# Altium project pca10095.PrjPCB (part 1 of 5)
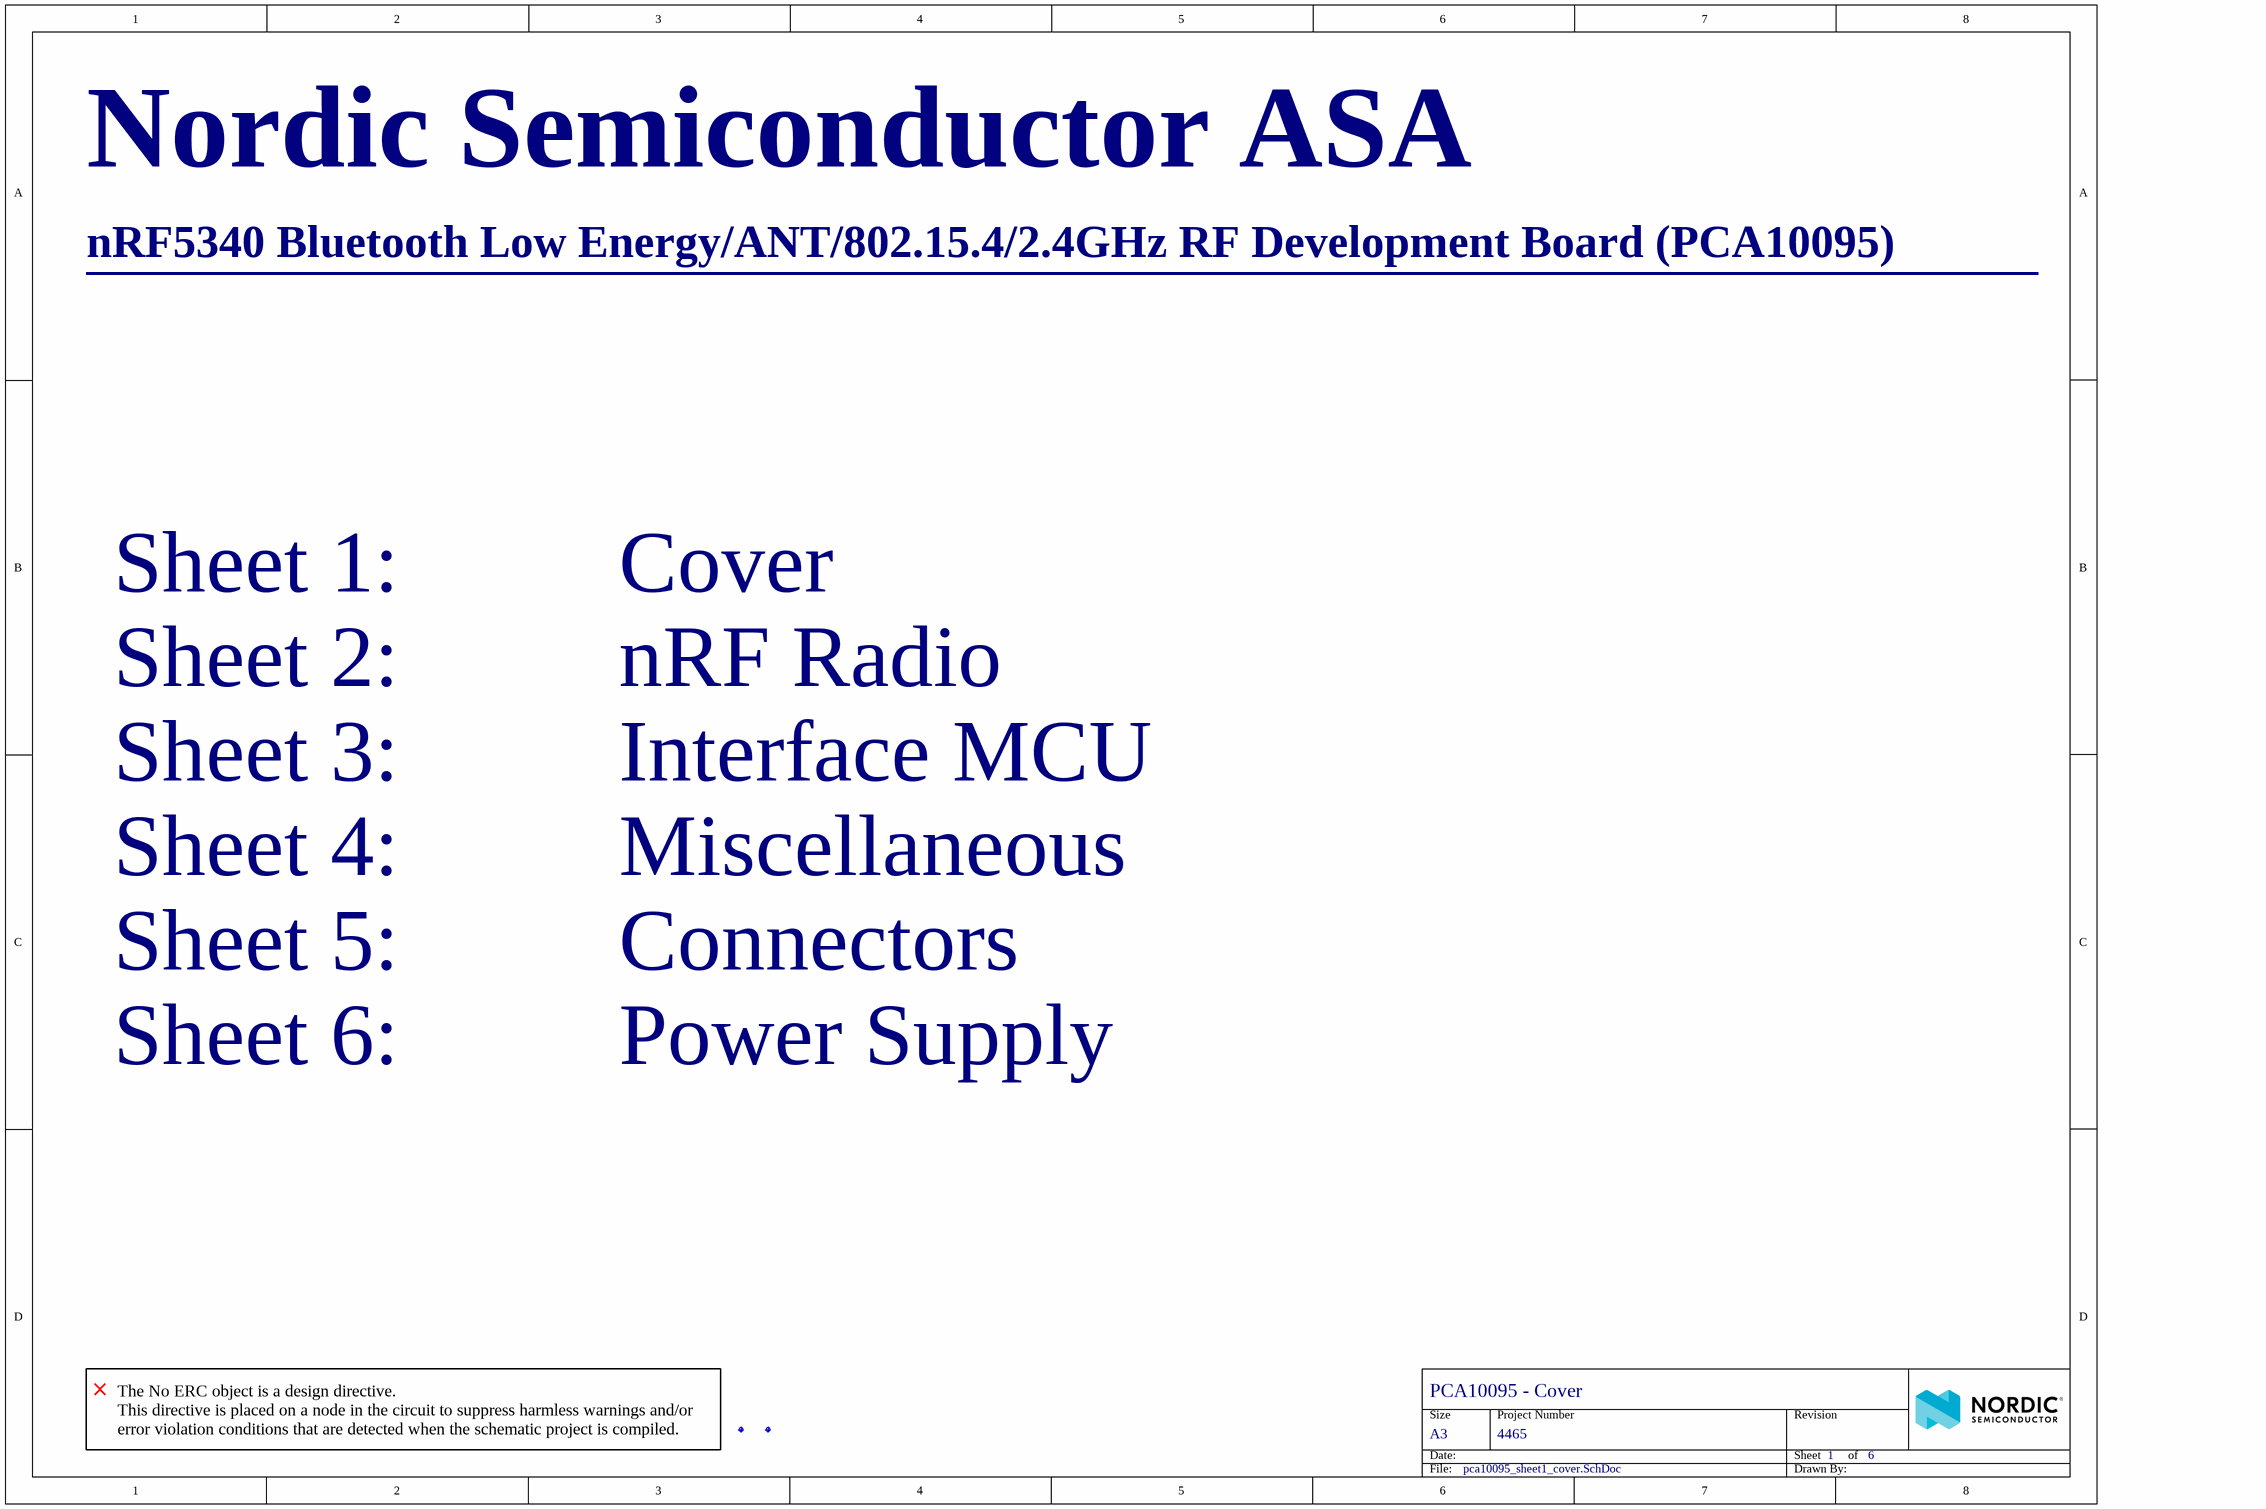
[diagram p0: pca10095_sheet1_cover.SchDoc]
Auth: GETR; BoardThickness: 1.6mm; BoardTitle: nRF5340 Bluetooth Smart/ANT/802.15.4/2.4GHz RF Development Board; NrOfLayers: 4; Organization: Nordic Semiconductor; PCAName: PCA10095; PCBNumber: 400432; PCBRevision: 0149GETR; PCBStackup: 4001; ProjectName: nRF53 Development Kit; ProjectNumber: 4465; Rev: 2.0.0; SilkscreenColor: White; SoldermaskColor: Blue; SurfaceFinish: ENIG Gold
6 sheets, 354 parts. Net scope: flat (ports and power ports of the same name join across sheets).
Board file: 400432.PcbDoc
Sheets:
  pca10095_sheet1_cover.SchDoc
  pca10095_sheet2_nrf5340_mcu.SchDoc
  pca10095_sheet3_interface_mcu.SchDoc
  pca10095_sheet4_misc.SchDoc
  pca10095_sheet5_connectors.SchDoc
  pca10095_sheet6_power_supply.SchDoc

## Sheet pca10095_sheet1_cover.SchDoc: PCA10095 - Cover
size A3; Organization: Nordic Semiconductor; DocumentNumber: 1; Revision: 2.0.0; SheetNumber: 1; SheetTotal: 6; Author: GETR; CompanyName: Nordic Semiconductor; ProjectName: nRF53 Development Kit

### Parts
Fid1  Fiducial mark  [Fiducial]  (value not drawn)
Fid2  Fiducial mark  [Fiducial]  (value not drawn)

### Notes on the sheet
- Nordic Semiconductor ASA
- nRF5340 Bluetooth Low Energy/ANT/802.15.4/2.4GHz RF Development Board (PCA10095)
- ________________________________________________________________
- Sheet 1:          Cover
- Sheet 2:          nRF Radio
- Sheet 3:          Interface MCU
- Sheet 4:          Miscellaneous
- Sheet 5:          Connectors
- Sheet 6:          Power Supply
- (near Fid1) The No ERC object is a design directive.
  This directive is placed on a node in the circuit to suppress harmless warnings and/or error violation conditions that are detected when the schematic project is compiled.
- Size
- Date:
- A3
- Project Number
- Sheet         of
- Revision
- File:
- Drawn By:

### Library data of the parts
Fid1 Fid2 = Fid-Mark: Artikkelnr Noca: N.A.; Part Number: Fid-Mark; Manufacturer: *; Manufacturer Part Number: *; LatestRevisionDate: 2009-12-12; Pin Count: 1; Publisher: Nordic Semiconductor; Published: 2009-12-12; Value: *; Note: *; Footprint Doc: Fiducial; Part number IPS: N.A.; ComponentLink1URL: *; ComponentLink1Description: Datasheet; ComponentLink2URL: *; ComponentLink2Description: Supplier link; HelpURL: *; Supplier 1: *; Supplier Part Number 1: *; Supplier 2: *; Supplier Part Number 2: *

## Sheet pca10095_sheet2_nrf5340_mcu.SchDoc: PCA10095 - nRF5340 MCU
size A3; Organization: Nordic Semiconductor; DocumentNumber: 2; Revision: 2.0.0; SheetNumber: 2; SheetTotal: 6; Author: GETR; CompanyName: Nordic Semiconductor; ProjectName: nRF53 Development Kit
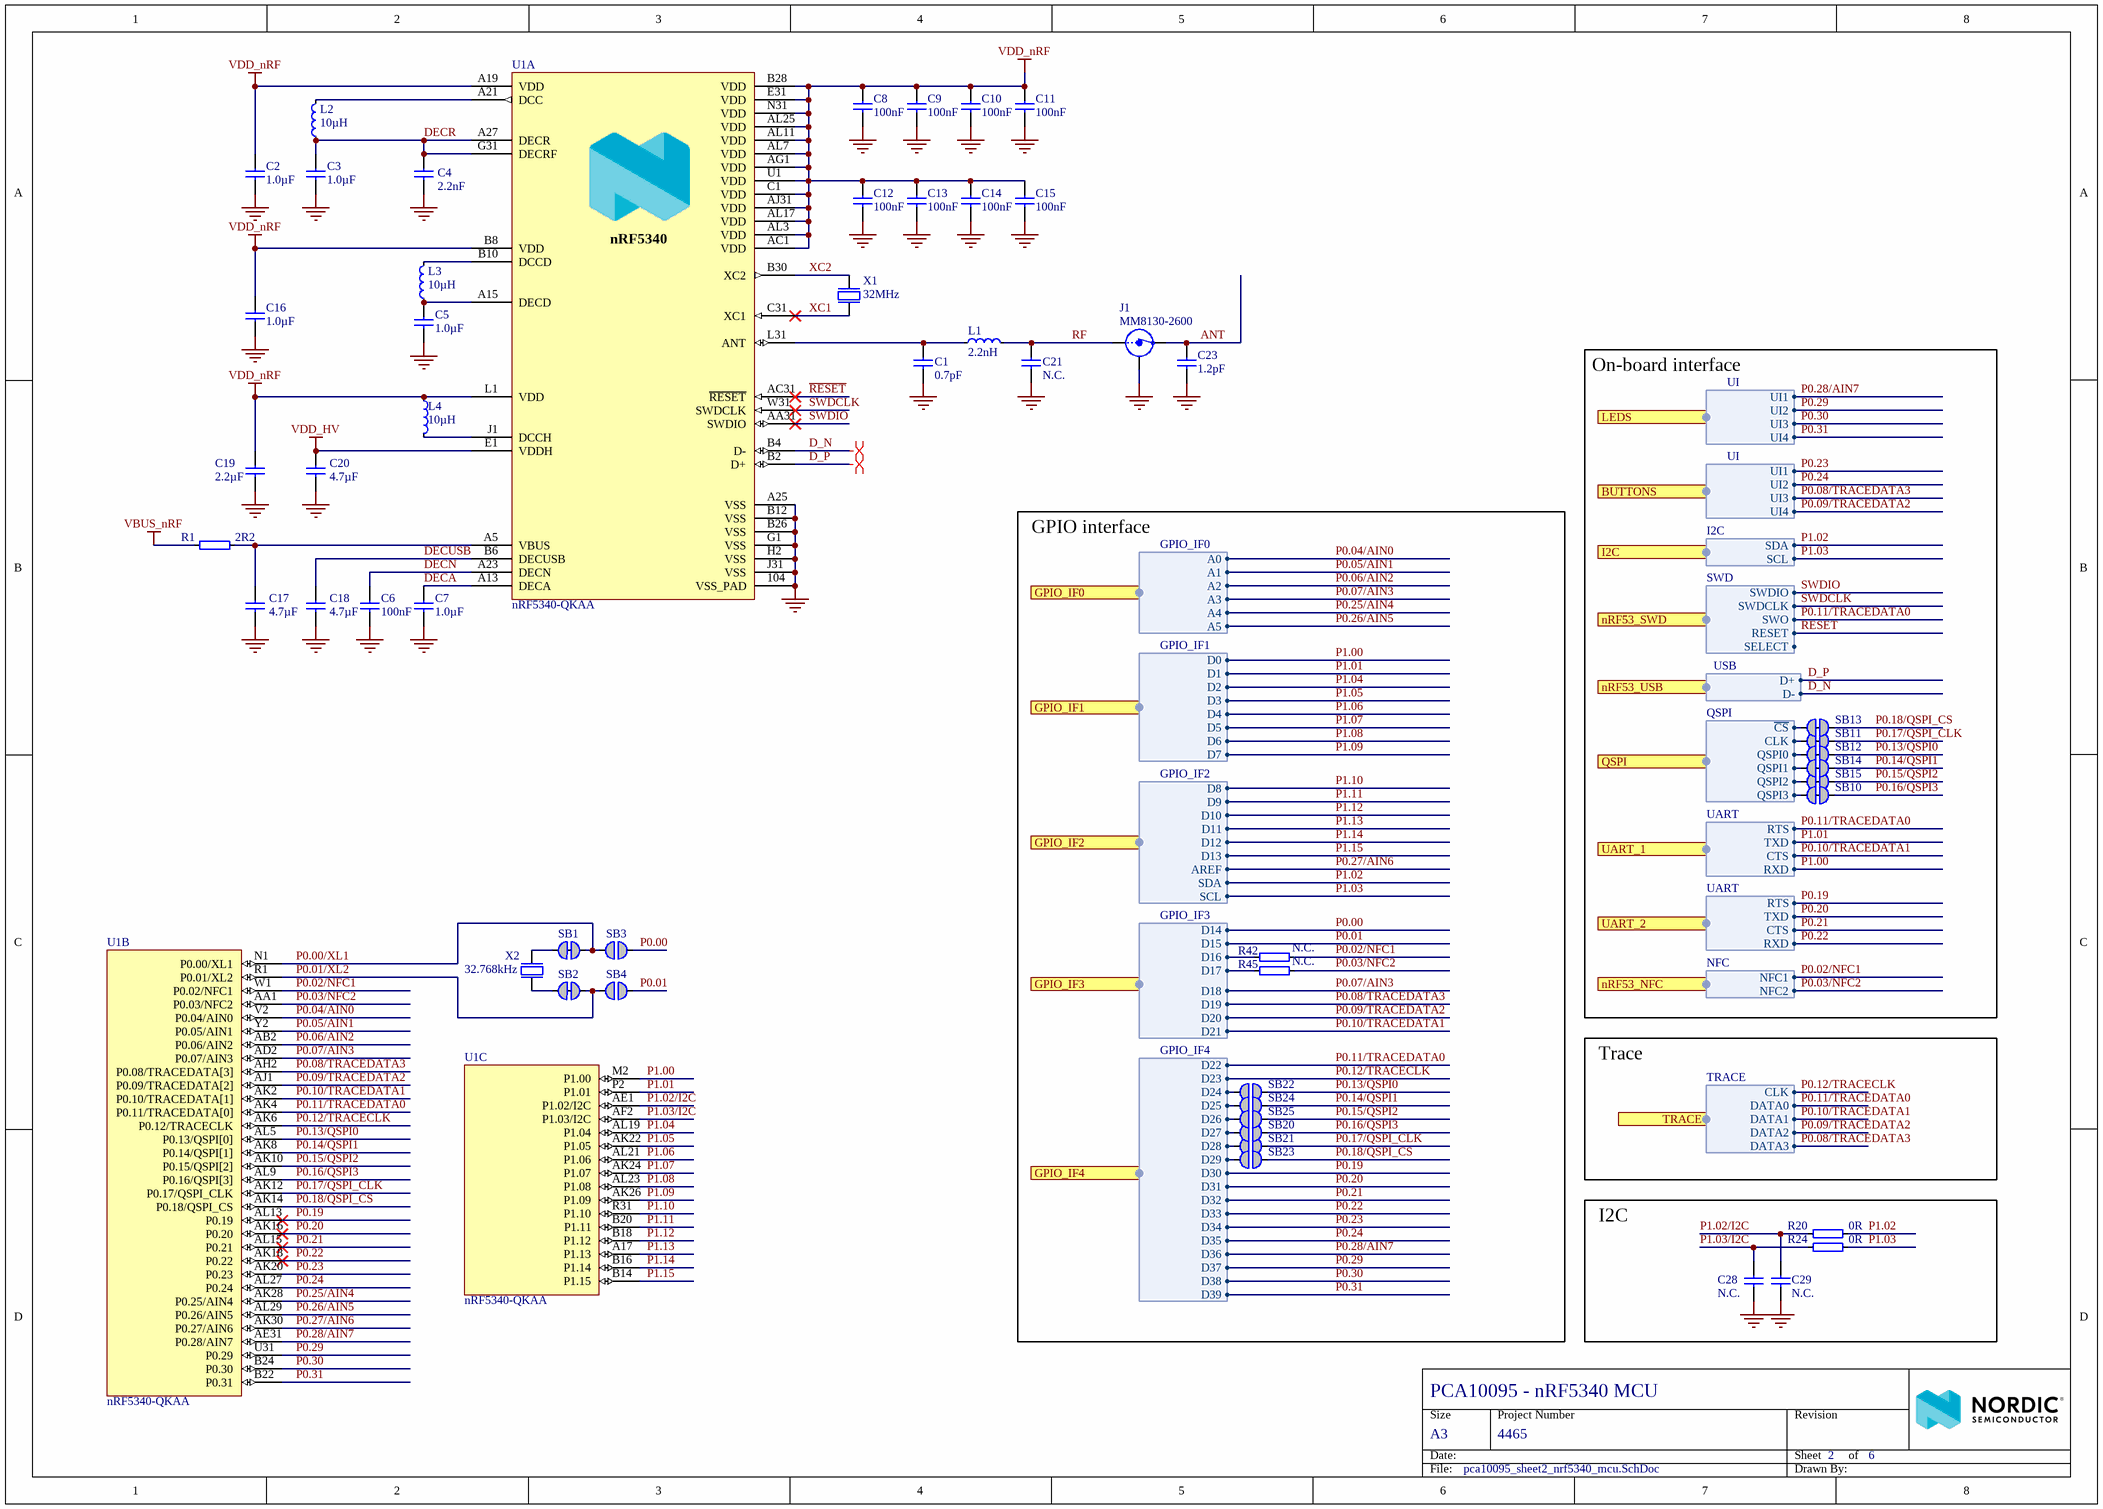
[diagram p1: pca10095_sheet2_nrf5340_mcu.SchDoc]

### Parts
C1  0.7pF  [CAPC0603X03L_C]
C2  1.0µF  [CAPC1005X04L]
C3  1.0µF  [CAPC1005X04L]
C4  2.2nF  [CAPC0603X03L_C]
C5  1.0µF  [CAPC1005X04L]
C6  100nF  [CAPC0603X03L_C]
C7  1.0µF  [CAPC1005X04L]
C8  100nF  [CAPC0603X03L_C]
C9  100nF  [CAPC0603X03L_C]
C10  100nF  [CAPC0603X03L_C]
C11  100nF  [CAPC0603X03L_C]
C12  100nF  [CAPC0603X03L_C]
C13  100nF  [CAPC0603X03L_C]
C14  100nF  [CAPC0603X03L_C]
C15  100nF  [CAPC0603X03L_C]
C16  1.0µF  [CAPC1005X04L]
C17  4.7µF  [CAPC1608X06L]
C18  4.7µF  [CAPC1608X06L]
C19  2.2µF  [CAPC1608X06L]
C20  4.7µF  [CAPC1608X06L]
C21  N.C.  [CAPC0603X03L_C_NC]
C23  1.2pF  [CAPC1005X04L]
C28  N.C.  [CAPC0603X03L_C_NC]
C29  N.C.  [CAPC0603X03L_C_NC]
J1  MM8130-2600  [COAXIAL-SWF]
L1  2.2nH  [INDC0603X03L_C]
L2  10µH  [INDC1608X06L]
L3  10µH  [INDC1608X06L]
L4  10µH  [INDC1608X06L]
R1  2R2  [RESC0603X03L_C]
R20  0R  [RESC0603X03L_C]
R24  0R  [RESC0603X03L_C]
R42  N.C.  [RESC0603X03L_C_NC]
R45  N.C.  [RESC0603X03L_C_NC]
SB1  Solderbridge  [Solderbridge_Shorted]  (value not drawn)  (net tie, no BOM)
SB2  Solderbridge  [Solderbridge_Shorted]  (value not drawn)  (net tie, no BOM)
SB3  Solderbridge  [Solderbridge]  (value not drawn)  (no BOM)
SB4  Solderbridge  [Solderbridge]  (value not drawn)  (no BOM)
SB10  Solderbridge  [Solderbridge_Shorted]  (value not drawn)  (net tie, no BOM)
SB11  Solderbridge  [Solderbridge_Shorted]  (value not drawn)  (net tie, no BOM)
SB12  Solderbridge  [Solderbridge_Shorted]  (value not drawn)  (net tie, no BOM)
SB13  Solderbridge  [Solderbridge_Shorted]  (value not drawn)  (net tie, no BOM)
SB14  Solderbridge  [Solderbridge_Shorted]  (value not drawn)  (net tie, no BOM)
SB15  Solderbridge  [Solderbridge_Shorted]  (value not drawn)  (net tie, no BOM)
SB20  Solderbridge  [Solderbridge]  (value not drawn)  (no BOM)
SB21  Solderbridge  [Solderbridge]  (value not drawn)  (no BOM)
SB22  Solderbridge  [Solderbridge]  (value not drawn)  (no BOM)
SB23  Solderbridge  [Solderbridge]  (value not drawn)  (no BOM)
SB24  Solderbridge  [Solderbridge]  (value not drawn)  (no BOM)
SB25  Solderbridge  [Solderbridge]  (value not drawn)  (no BOM)
U1  nRF5340-QKAA  [AQFN40P700X700X85_HS-99N]  (parts A,B,C of 3)
X1  32MHz  [BT-XTAL_2016]
X2  32.768kHz  [XTAL_2012]

### Blocks framed on the sheet
On-board interface: SB10-SB15
GPIO interface: R42 R45 SB20-SB25
I2C: C28 C29 R20 R24

### Ports
BUTTONS (harness UI), GPIO_IF0 (harness GPIO_IF0), GPIO_IF1 (harness GPIO_IF1), GPIO_IF2 (harness GPIO_IF2), GPIO_IF3 (harness GPIO_IF3), GPIO_IF4 (harness GPIO_IF4), I2C (harness I2C), LEDS (harness UI), nRF53_NFC (harness NFC), nRF53_SWD (harness SWD), nRF53_USB (harness USB), QSPI (harness QSPI), TRACE (harness TRACE), UART_1 (harness UART), UART_2 (harness UART)

### Harnesses
QSPI: ~{CS}, QSPI0, CLK, QSPI1, QSPI2, QSPI3
SWD: SWDIO, SWDCLK, SWO, RESET, SELECT
UI: UI4, UI3, UI2, UI1
USB: D+, D-
TRACE: CLK, DATA0, DATA1, DATA3, DATA2
NFC: NFC2, NFC1
UART: RTS, CTS, RXD, TXD
GPIO_IF1: D0, D1, D2, D3, D4, D5, D6, D7
GPIO_IF2: D8, D9, D10, D11, D12, D13, AREF, SDA, SCL
GPIO_IF0: A0, A1, A2, A3, A4, A5
GPIO_IF3: D14, D15, D16, D17, D18, D19, D20, D21
I2C: SCL, SDA
GPIO_IF4: D22, D23, D24, D25, D26, D27, D28, D29, D30, D31, D32, D33, D34, D35, D36, D37, D38, D39

### Nets
GND: C1.1 C2.2 C3.1 C4.2 C5.1 C6.2 C7.1 C8.2 C9.2 C10.2 C11.2 C12.2 C13.2 C14.2 C15.2 C16.1 C17.2 C18.2 C19.2 C20.2 C21.1 C23.2 C28.1 C29.1 J1.2(Shield) U1.104(VSS_PAD) U1.A25(VSS) U1.B12(VSS) U1.B26(VSS) U1.G1(VSS) U1.H2(VSS) U1.J31(VSS) X1.2(GND) X1.4(GND)
VBUS_nRF: R1.1
VDD_HV: C20.1 U1.E1(VDDH)
VDD_nRF: C2.1 C8.1 C9.1 C10.1 C11.1 C12.1 C13.1 C14.1 C15.1 C16.2 C19.1 L4.1 U1.A19(VDD) U1.AC1(VDD) U1.AG1(VDD) U1.AJ31(VDD) U1.AL3(VDD) U1.AL7(VDD) U1.AL11(VDD) U1.AL17(VDD) U1.AL25(VDD) U1.B8(VDD) U1.B28(VDD) U1.C1(VDD) U1.E31(VDD) U1.L1(VDD) U1.N31(VDD) U1.U1(VDD)
ANT: C23.1 J1.3(OUT)
D_N: U1.B4(D-) ; port nRF53_USB.D-
D_P: U1.B2(D+) ; port nRF53_USB.D+
DECA: C7.2 U1.A13(DECA)
DECN: C6.1 U1.A23(DECN)
DECR: C3.2 C4.1 L2.1 U1.A27(DECR) U1.G31(DECRF)
DECUSB: C18.1 U1.B6(DECUSB)
MX25_~{CS}: SB13.2 ; port QSPI.~{CS}
MX25_SCLK: SB11.2 ; port QSPI.CLK
MX25_SIO0: SB12.2 ; port QSPI.QSPI0
MX25_SIO1: SB14.2 ; port QSPI.QSPI1
MX25_SIO2: SB15.2 ; port QSPI.QSPI2
MX25_SIO3: SB10.2 ; port QSPI.QSPI3
P0.00: SB3.2 ; port GPIO_IF3.D14
P0.00/XL1: SB1.2 SB3.1 U1.N1(P0.00/XL1)
P0.01: SB4.2 ; port GPIO_IF3.D15
P0.01/XL2: SB2.2 SB4.1 U1.R1(P0.01/XL2)
P0.02/NFC1: R42.2 U1.W1(P0.02/NFC1) ; port nRF53_NFC.NFC1
P0.03/NFC2: R45.2 U1.AA1(P0.03/NFC2) ; port nRF53_NFC.NFC2
P0.04/AIN0: U1.V2(P0.04/AIN0) ; port GPIO_IF0.A0
P0.05/AIN1: U1.Y2(P0.05/AIN1) ; port GPIO_IF0.A1
P0.06/AIN2: U1.AB2(P0.06/AIN2) ; port GPIO_IF0.A2
P0.07/AIN3: U1.AD2(P0.07/AIN3) ; port GPIO_IF0.A3, port GPIO_IF3.D18
P0.08/TRACEDATA3: U1.AH2(P0.08/TRACEDATA[3]) ; port BUTTONS.UI3, port TRACE.DATA3, port GPIO_IF3.D19
P0.09/TRACEDATA2: U1.AJ1(P0.09/TRACEDATA[2]) ; port BUTTONS.UI4, port TRACE.DATA2, port GPIO_IF3.D20
P0.10/TRACEDATA1: U1.AK2(P0.10/TRACEDATA[1]) ; port TRACE.DATA1, port GPIO_IF3.D21, port UART_1.CTS
P0.11/TRACEDATA0: U1.AK4(P0.11/TRACEDATA[0]) ; port nRF53_SWD.SWO, port TRACE.DATA0, port GPIO_IF4.D22, port UART_1.RTS
P0.12/TRACECLK: U1.AK6(P0.12/TRACECLK) ; port TRACE.CLK, port GPIO_IF4.D23
P0.13/QSPI0: SB12.1 SB22.1 U1.AL5(P0.13/QSPI[0])
P0.14/QSPI1: SB14.1 SB24.1 U1.AK8(P0.14/QSPI[1])
P0.15/QSPI2: SB15.1 SB25.1 U1.AK10(P0.15/QSPI[2])
P0.16/QSPI3: SB10.1 SB20.1 U1.AL9(P0.16/QSPI[3])
P0.17/QSPI_CLK: SB11.1 SB21.1 U1.AK12(P0.17/QSPI_CLK)
P0.18/QSPI_CS: SB13.1 SB23.1 U1.AK14(P0.18/QSPI_CS)
P0.19: U1.AL13(P0.19) ; port UART_2.RTS, port GPIO_IF4.D30
P0.20: U1.AK16(P0.20) ; port UART_2.TXD, port GPIO_IF4.D31
P0.21: U1.AL15(P0.21) ; port UART_2.CTS, port GPIO_IF4.D32
P0.22: U1.AK18(P0.22) ; port UART_2.RXD, port GPIO_IF4.D33
P0.23: U1.AK20(P0.23) ; port BUTTONS.UI1, port GPIO_IF4.D34
P0.24: U1.AL27(P0.24) ; port BUTTONS.UI2, port GPIO_IF4.D35
P0.25/AIN4: U1.AK28(P0.25/AIN4) ; port GPIO_IF0.A4
P0.26/AIN5: U1.AL29(P0.26/AIN5) ; port GPIO_IF0.A5
P0.27/AIN6: U1.AK30(P0.27/AIN6) ; port GPIO_IF2.AREF
P0.28/AIN7: U1.AE31(P0.28/AIN7) ; port LEDS.UI1, port GPIO_IF4.D36
P0.29: U1.U31(P0.29) ; port LEDS.UI2, port GPIO_IF4.D37
P0.30: U1.B24(P0.30) ; port LEDS.UI3, port GPIO_IF4.D38
P0.31: U1.B22(P0.31) ; port LEDS.UI4, port GPIO_IF4.D39
P1.00: U1.M2(P1.00) ; port GPIO_IF1.D0, port UART_1.RXD
P1.01: U1.P2(P1.01) ; port GPIO_IF1.D1, port UART_1.TXD
P1.02: R20.1 ; port GPIO_IF2.SDA, port I2C.SDA
P1.02/I2C: C29.2 R20.2 U1.AE1(P1.02/I2C)
P1.03: R24.1 ; port GPIO_IF2.SCL, port I2C.SCL
P1.03/I2C: C28.2 R24.2 U1.AF2(P1.03/I2C)
P1.04: U1.AL19(P1.04) ; port GPIO_IF1.D2
P1.05: U1.AK22(P1.05) ; port GPIO_IF1.D3
P1.06: U1.AL21(P1.06) ; port GPIO_IF1.D4
P1.07: U1.AK24(P1.07) ; port GPIO_IF1.D5
P1.08: U1.AL23(P1.08) ; port GPIO_IF1.D6
P1.09: U1.AK26(P1.09) ; port GPIO_IF1.D7
P1.10: U1.R31(P1.10) ; port GPIO_IF2.D8
P1.11: U1.B20(P1.11) ; port GPIO_IF2.D9
P1.12: U1.B18(P1.12) ; port GPIO_IF2.D10
P1.13: U1.A17(P1.13) ; port GPIO_IF2.D11
P1.14: U1.B16(P1.14) ; port GPIO_IF2.D12
P1.15: U1.B14(P1.15) ; port GPIO_IF2.D13
~{RESET}: U1.AC31(~{RESET}) ; port nRF53_SWD.RESET
RF: C21.2 J1.1(IN) L1.2
SWDCLK: U1.W31(SWDCLK) ; port nRF53_SWD.SWDCLK
SWDIO: U1.AA31(SWDIO) ; port nRF53_SWD.SWDIO
XC1: U1.C31(XC1) X1.1(inp)
XC2: U1.B30(XC2) X1.3(out)
NetC1_2: C1.2 L1.1 U1.L31(ANT)
NetC5_2: C5.2 L3.1 U1.A15(DECD)
NetC17_1: C17.1 R1.2 U1.A5(VBUS)
NetL2_2: L2.2 U1.A21(DCC)
NetL3_2: L3.2 U1.B10(DCCD)
NetL4_2: L4.2 U1.J1(DCCH)
NetP6_3: R42.1 ; port GPIO_IF3.D16
NetP6_4: R45.1 ; port GPIO_IF3.D17
NetP24_3: SB22.2 ; port GPIO_IF4.D24
NetP24_4: SB24.2 ; port GPIO_IF4.D25
NetP24_5: SB25.2 ; port GPIO_IF4.D26
NetP24_6: SB20.2 ; port GPIO_IF4.D27
NetP24_7: SB21.2 ; port GPIO_IF4.D28
NetP24_8: SB23.2 ; port GPIO_IF4.D29
NetSB1_1: SB1.1 X2.1(inp)
NetSB2_1: SB2.1 X2.2(out)

Not connected (* = marked no-connect by the designer): U1 AG31(N.C.) D2(N.C.) F2(N.C.) T2(N.C.)

### Layout directives
differential pair: D_N, D_P

### Notes on the sheet
- Trace
- Size
- Date:
- A3
- Project Number
- Sheet         of
- Revision
- File:
- Drawn By:
- (in symbol nRF5340-QKAAD0, part A) nRF5340

### Library data of the parts
C1 = C0201-0.7p-HQ-Murata: Ceramic Capacitor C0G, NP0 0201, ±0.1pF 25V; Manufacturer: Murata; Manufacturer Part Number: GJM0335C1ER70BB01D; Artikkelnr Noca: N.A.; Pad Count: 2; Part Number: C0201-0.7p-HQ-Murata; LatestRevisionDate: 2020-10-13; Pin Count: 2; Publisher: Nordic Semiconductor; Published: 2020-03-05; Value: 0.7pF; Note: 25V; Footprint Doc: 0201; ComponentLink1URL: https://search.murata.co.jp/Ceramy/image/img/A01X/G101/ENG/GJM0335C1ER70BB01-01.pdf; ComponentLink1Description: Datasheet; ComponentLink2URL: https://www.murata.com/en-eu/products/productdetail?partno=GJM0335C1ER70BB01%23; ComponentLink2Description: Supplier link; HelpURL: https://www.digikey.no/product-detail/en/murata-electronics/GJM0335C1ER70BB01D/490-8076-1-ND/4380362; Supplier 1: Digi-Key; Supplier Part Number 1: 490-8076-1-ND; Supplier 2: N.A.; Supplier Part Number 2: N.A.; Part number IPS: N.A.; Component Class: Capacitors; PartId: 100200441
C2 C3 C5 C7 C16 = C0402-1µ0: Capacitor, X5R, ±5%, 6.3V; Manufacturer: N.A.; Part number IPS: 00000007786, 00000003457; Artikkelnr Noca: 20039235; Pad Count: 2; Part Number: C0402-1µ0; Manufacturer Part Number: N.A.; LatestRevisionDate: 2016-08-22; Pin Count: 2; Publisher: Nordic Semiconductor; Published: 2009-05-08; Value: 1.0µF; Note: 6.3V; Footprint Doc: 0402; ComponentLink1URL: N.A.; ComponentLink1Description: Datasheet; ComponentLink2URL: N.A.; ComponentLink2Description: Supplier link; HelpURL: N.A.; Supplier 1: Digi-Key; Supplier Part Number 1: 1276-1444-1-ND; Supplier 2: N.A.; Supplier Part Number 2: N.A.; Component Class: Capacitors; PartId: 100200190
C4 = C0201-2n2: Capacitor, X7R, ±10%, 10V; Manufacturer: N.A.; Part number IPS: 00000001778; Pad Count: 2; Part Number: C0201-2n2; LatestRevisionDate: 2014-11-13; Pin Count: 2; Published: 2014-11-13; Value: 2.2nF; Footprint Doc: 0201; Manufacturer Part Number: N.A.; ComponentLink1URL: N.A.; ComponentLink1Description: Datasheet; ComponentLink2URL: N.A.; ComponentLink2Description: Supplier link; HelpURL: N.A.; Publisher: Nordic Semiconductor; Note: 10V; Supplier 1: N.A.; Supplier Part Number 1: N.A.; Supplier 2: N.A.; Supplier Part Number 2: N.A.; Artikkelnr Noca: N.A.; Component Class: Capacitors; PartId: 100200060
C6 C8-C15 = C0201-100n: Capacitor, X5R, ±10%; Manufacturer: N.A.; Part number IPS: 00000001248, 00000002505; Note: 16V; Pad Count: 2; Part Number: C0201-100n; Manufacturer Part Number: N.A.; LatestRevisionDate: 2017-11-09; Pin Count: 2; Publisher: Nordic Semiconductor; Published: 2014-11-13; Value: 100nF; Artikkelnr Noca: N.A.; Footprint Doc: 0201; ComponentLink1URL: N.A.; ComponentLink1Description: Datasheet; ComponentLink2URL: N.A.; ComponentLink2Description: Supplier link; HelpURL: N.A.; Supplier 1: N.A.; Supplier Part Number 1: N.A.; Supplier 2: N.A.; Supplier Part Number 2: N.A.; Component Class: Capacitors; PartId: 100200078
C17 C18 C20 = C0603-4µ7-10V-X7S: Capacitor, X7S, ±10%, 10V; Manufacturer: N.A.; Part number IPS: 00000001779; Artikkelnr Noca: 20030013; Pad Count: 2; Part Number: C0603-4µ7-10V-X7S; LatestRevisionDate: 2016-08-15; Pin Count: 2; Publisher: Nordic Semiconductor; Published: 2016-08-15; Value: 4.7µF; Note: 10V; Footprint Doc: 0603; Manufacturer Part Number: N.A.; ComponentLink1URL: N.A.; ComponentLink1Description: Datasheet; ComponentLink2URL: N.A.; ComponentLink2Description: Supplier link; HelpURL: N.A.; Supplier 1: Digi-Key; Supplier Part Number 1: 445-14258-1-ND; Supplier 2: N.A.; Supplier Part Number 2: N.A.; Component Class: Capacitors; PartId: 100200351
C19 = C0603-2µ2: Capacitor, X7R, ±10%; Manufacturer: N.A.; Note: 6.3V; Artikkelnr Noca: 20039322; Pad Count: 2; Part Number: C0603-2µ2; Manufacturer Part Number: N.A.; LatestRevisionDate: 2016-10-10; Pin Count: 2; Publisher: Nordic Semiconductor; Published: 2009-05-08; Value: 2.2µF; Footprint Doc: 0603; ComponentLink1URL: N.A.; ComponentLink1Description: Datasheet; ComponentLink2URL: N.A.; ComponentLink2Description: Supplier link; HelpURL: N.A.; Supplier 1: N.A.; Supplier Part Number 1: N.A.; Supplier 2: N.A.; Supplier Part Number 2: N.A.; Part number IPS: N.A.; Component Class: Capacitors; PartId: 100200272
C21 = C0201-N.C.: Not mounted; Manufacturer: N.A.; Note: Chip Cap; Assembly: Not mounted; Pad Count: 2; Part Number: C0201-N.C.; LatestRevisionDate: 2014-11-13; Pin Count: 2; Publisher: Nordic Semiconductor; Published: 2014-11-13; Value: N.C.; Footprint Doc: 0201; Manufacturer Part Number: N.A.; Artikkelnr Noca: N.A.; Part number IPS: N.A.; ComponentLink1URL: N.A.; ComponentLink1Description: Datasheet; ComponentLink2URL: N.A.; ComponentLink2Description: Supplier link; HelpURL: N.A.; Supplier 1: N.A.; Supplier Part Number 1: N.A.; Supplier 2: N.A.; Supplier Part Number 2: N.A.; Component Class: Capacitors; PartId: 100200001
C23 = C0402-1.2p: Capacitor, NP0, ±0.1pF; Manufacturer: N.A.; Part number IPS: 00000005410; Note: 50V; Artikkelnr Noca: 20029157; Pad Count: 2; Part Number: C0402-1.2p; Manufacturer Part Number: N.A.; LatestRevisionDate: 2011-05-11; Pin Count: 2; Publisher: Nordic Semiconductor; Published: 2009-05-08; Value: 1.2pF; Footprint Doc: 0402; ComponentLink1URL: N.A.; ComponentLink1Description: Datasheet; ComponentLink2URL: N.A.; ComponentLink2Description: Supplier link; HelpURL: N.A.; Supplier 1: N.A.; Supplier Part Number 1: N.A.; Supplier 2: N.A.; Supplier Part Number 2: N.A.; Component Class: Capacitors; PartId: 100200119
C28 C29 = C0201-N.C.: Not mounted; Manufacturer: N.A.; Assembly: Not mounted; Note: Chip Cap; Pad Count: 2; Part Number: C0201-N.C.; Manufacturer Part Number: N.A.; Footprint Doc: 0201; LatestRevisionDate: 2014-11-13; Pin Count: 2; Publisher: Nordic Semiconductor; Published: 2014-11-13; Value: N.C.; Artikkelnr Noca: N.A.; Part number IPS: N.A.; ComponentLink1URL: N.A.; ComponentLink1Description: Datasheet; ComponentLink2URL: N.A.; ComponentLink2Description: Supplier link; HelpURL: N.A.; Supplier 1: N.A.; Supplier Part Number 1: N.A.; Supplier 2: N.A.; Supplier Part Number 2: N.A.; Component Class: Capacitors; PartId: 100200001
J1 = MM8130-2600: Coaxial Connector with Switch; Manufacturer: Murata; Part number IPS: 00000009955; Note: N.A.; Artikkelnr Noca: 55029011; Pad Count: 3; Part Number: MM8130-2600; Manufacturer Part Number: MM8130-2600; LatestRevisionDate: 2014-04-24; Pin Count: 3; Publisher: Nordic Semiconductor; Published: 2014-04-24; Value: MM8130-2600; Footprint Doc: COAXIAL-SWF; ComponentLink1URL: N.A.; ComponentLink1Description: Datasheet; ComponentLink2URL: N.A.; ComponentLink2Description: Supplier link; HelpURL: http://www.murata.com/products/catalog/pdf/o33e.pdf; Supplier 1: Digi-Key; Supplier Part Number 1: 490-4981-1-ND; Supplier 2: Mouser; Supplier Part Number 2: 81-MM8130-2600RA2; Component Class: Connectors; PartId: 100500400
L1 = L0201-2n2-0.1nH: FIXED IND 2.2NH 600MA 120 MOHM; Manufacturer: Murata; Manufacturer Part Number: LQP03HQ2N2B02D; Note: High frequency chip inductor ±5%; Artikkelnr Noca: N.A.; Pad Count: 2; Part Number: L0201-2n2-0.1nH; ComponentLink1URL: https://search.murata.co.jp/Ceramy/image/img/P02/JELF243C-0021.pdf; ComponentLink1Description: Datasheet; ComponentLink2URL: https://www.murata.com/en-eu/products/productdetail?partno=LQP03HQ2N2B02%23; ComponentLink2Description: Supplier link; HelpURL: https://www.digikey.no/product-detail/en/murata-electronics/LQP03HQ2N2B02D/490-13899-1-ND/6098849; Footprint Doc: 0201; LatestRevisionDate: 2020-03-05; Pin Count: 2; Publisher: Nordic Semiconductor; Published: 2020-03-05; Value: 2.2nH; Supplier 1: Digi-Key; Supplier Part Number 1: 490-13899-1-ND; Supplier 2: N.A.; Supplier Part Number 2: N.A.; Part number IPS: N.A.; Component Class: Inductors; PartId: 100300398
L2-L4 = L0603-10µ-TDK: Inductor, 250mA, ±20%, 1.05ohm. -55°C ~ 125°C; Manufacturer: TDK Corporation; Manufacturer Part Number: MLZ1608M100WTD25; Note: N.A.; Pad Count: 2; Part Number: L0603-10µ-TDK; LatestRevisionDate: 2012-09-19; Pin Count: 2; Publisher: Nordic Semiconductor; Published: 2019-05-06; Value: 10µH; Artikkelnr Noca: N.A.; Footprint Doc: 0603; ComponentLink1URL: N.A.; ComponentLink1Description: Datasheet; ComponentLink2URL: N.A.; ComponentLink2Description: Supplier link; HelpURL: https://product.tdk.com/info/en/catalog/datasheets/inductor_automotive_decoupling_mlz1608_en.pdf; Supplier 1: Digi-Key; Supplier Part Number 1: 445-175588-1-ND; Supplier 2: Mouser; Supplier Part Number 2: 810-MLZ1608M100WTD25; Part number IPS: N.A.; Component Class: Inductors; PartId: 100300079
R1 = R0201-2R2: Resistor, ±1%, 0.05W; Manufacturer: N.A.; Note: Chip Res 1%; Pad Count: 2; Part Number: R0201-2R2; Manufacturer Part Number: N.A.; ComponentLink1URL: N.A.; ComponentLink1Description: Datasheet; ComponentLink2URL: N.A.; ComponentLink2Description: Supplier link; HelpURL: N.A.; Footprint Doc: 0201; LatestRevisionDate: 2014-11-13; Published: 2014-11-13; Value: 2R2; Supplier 1: N.A.; Supplier Part Number 1: N.A.; Supplier 2: N.A.; Supplier Part Number 2: N.A.; Artikkelnr Noca: N.A.; Part number IPS: N.A.; Component Class: Resistors; PartId: 100100006; Author: rsk; Part number Norautron: N.A.
R20 R24 = R0201-0R: Resistor, ±5%, 0.05W; Manufacturer: N.A.; Part number IPS: 00000003245; Note: Chip Res 5%; Pad Count: 2; Part Number: R0201-0R; Manufacturer Part Number: N.A.; Footprint Doc: 0201; LatestRevisionDate: 2017-11-09; Pin Count: 2; Publisher: Nordic Semiconductor; Published: 2014-11-13; Value: 0R; Artikkelnr Noca: N.A.; ComponentLink1URL: N.A.; ComponentLink1Description: Datasheet; ComponentLink2URL: N.A.; ComponentLink2Description: Supplier link; HelpURL: N.A.; Supplier 1: N.A.; Supplier Part Number 1: N.A.; Supplier 2: N.A.; Supplier Part Number 2: N.A.; Component Class: Resistors; PartId: 100100001
R42 R45 = R0201-N.C.: Not mounted; Manufacturer: N.A.; Note: Chip Res; Assembly: Not mounted; Pad Count: 2; Part Number: R0201-N.C.; Manufacturer Part Number: N.A.; Footprint Doc: 0201; LatestRevisionDate: 2014-11-13; Pin Count: 2; Publisher: Nordic Semiconductor; Published: 2014-11-13; Value: N.C.; Artikkelnr Noca: N.A.; Part number IPS: N.A.; ComponentLink1URL: N.A.; ComponentLink1Description: Datasheet; ComponentLink2URL: N.A.; ComponentLink2Description: Supplier link; HelpURL: N.A.; Supplier 1: N.A.; Supplier Part Number 1: N.A.; Supplier 2: N.A.; Supplier Part Number 2: N.A.; Component Class: Resistors; PartId: 100100107
SB1 SB2 SB10-SB15 = Solderbridge Shorted: Shorted Solderbridge; Manufacturer: N.A.; Pad Count: 2; Part Number: Solderbridge Shorted; Manufacturer Part Number: N.A.; LatestRevisionDate: 2012-08-07; Pin Count: 2; Publisher: Nordic Semiconductor; Published: 2012-08-07; Value: Solderbridge; Note: N.A.; Artikkelnr Noca: N.A.; Footprint Doc: Solderbridge_Shorted; Part number IPS: N.A.; ComponentLink1URL: N.A.; ComponentLink1Description: Datasheet; ComponentLink2URL: N.A.; ComponentLink2Description: Supplier link; HelpURL: N.A.; Supplier 1: N.A.; Supplier Part Number 1: N.A.; Supplier 2: N.A.; Supplier Part Number 2: N.A.; Component Class: Connectors; PartId: 100500459
SB3 SB4 SB20-SB25 = Solderbridge: Manufacturer: N.A.; Pad Count: 2; Part Number: Solderbridge; Manufacturer Part Number: N.A.; LatestRevisionDate: 2009-12-14; Pin Count: 2; Publisher: Nordic Semiconductor; Published: 2009-12-14; Value: Solderbridge; Note: N.A.; Artikkelnr Noca: N.A.; Footprint Doc: Solderbridge; Part number IPS: N.A.; ComponentLink1URL: N.A.; ComponentLink1Description: Datasheet; ComponentLink2URL: N.A.; ComponentLink2Description: Supplier link; HelpURL: N.A.; Supplier 1: N.A.; Supplier Part Number 1: N.A.; Supplier 2: N.A.; Supplier Part Number 2: N.A.; Component Class: Connectors; PartId: 100500458
U1 = nRF5340-QKAAD0: Multi-protocol Bluetooth Low Energy, IEEE 802.15.4, ANT and 2.4GHz proprietary system-on-chip; Manufacturer: Nordic Semiconductor; Note: N.A.; Pad Count: 98; Part Number: nRF5340-QKAAD0; Manufacturer Part Number: nRF5340-QKAAD0; Footprint Doc: AQFN-98; LatestRevisionDate: 2020-12-02; Published: 2020-12-02; Value: nRF5340-QKAA; Artikkelnr Noca: N.A.; Part number IPS: N.A.; ComponentLink1URL: N.A.; ComponentLink1Description: Datasheet; ComponentLink2URL: N.A.; ComponentLink2Description: Supplier link; HelpURL: N.A.; Supplier 1: Nordic Semiconductor; Supplier Part Number 1: nRF5340-QKAAD0; Supplier 2: N.A.; Supplier Part Number 2: N.A.; Component Class: nRF_Devices; PartId: 102000216; Author: rsk; Part number Norautron: N.A.
X1 = XTAL_SMD2016_32MHz_8pF_Golledge: XTAL SMD 2016, 32MHz, Cl=8pF, Tol: ±10ppm, Stab: ±15ppm; Manufacturer Part Number: MP06003; Part number IPS: 00000001431; Note: XTAL SMD 32.000MHz; Artikkelnr Noca: 22010050; Pad Count: 4; Part Number: XTAL_SMD2016_32MHz_8pF_Golledge; Manufacturer: Golledge; LatestRevisionDate: 2016-11-02; Published: 2016-11-02; Value: 32MHz; Footprint Doc: XTAL_2016; ComponentLink1URL: N.A.; ComponentLink1Description: Datasheet; ComponentLink2URL: N.A.; ComponentLink2Description: Supplier link; HelpURL: \\hizz\pro\app9717\Datasheet\crystals\Golledge\mp06003.pdf; Supplier 1: Link Nordic; Supplier Part Number 1: N.A.; Supplier 2: N.A.; Supplier Part Number 2: N.A.; PartId: 101600041; Component Class: Oscillators
X2 = XTAL_SMD2012_32.768kHz_9pF_Golledge: XTAL SMD 2012, 32.768kHz, 9pF, ±20ppm; Manufacturer Part Number: MP07668; Note: XTAL SMD 32.768kHz; Artikkelnr Noca: N.A.; Pad Count: 2; Part Number: XTAL_SMD2012_32.768kHz_9pF_Golledge; Manufacturer: Golledge; LatestRevisionDate: 2016-11-02; Pin Count: 2; Publisher: Nordic Semiconductor; Published: 2016-11-02; Value: 32.768kHz; Footprint Doc: XTAL_2012; Part number IPS: N.A.; ComponentLink1URL: N.A.; ComponentLink1Description: Datasheet; ComponentLink2URL: N.A.; ComponentLink2Description: Supplier link; HelpURL: \\hizz\pro\app9717\Datasheet\crystals\Golledge\mp07668.pdf; Supplier 1: Link Nordic; Supplier Part Number 1: N.A.; Supplier 2: N.A.; Supplier Part Number 2: N.A.; Component Class: Oscillators; PartId: 101600017

## Sheet pca10095_sheet3_interface_mcu.SchDoc: PCA10095 - Interface MCU
size A3; Organization: Nordic Semiconductor; DocumentNumber: 3; Revision: 2.0.0; SheetNumber: 3; SheetTotal: 6; Author: GETR; CompanyName: Nordic Semiconductor; ProjectName: nRF53 Development Kit
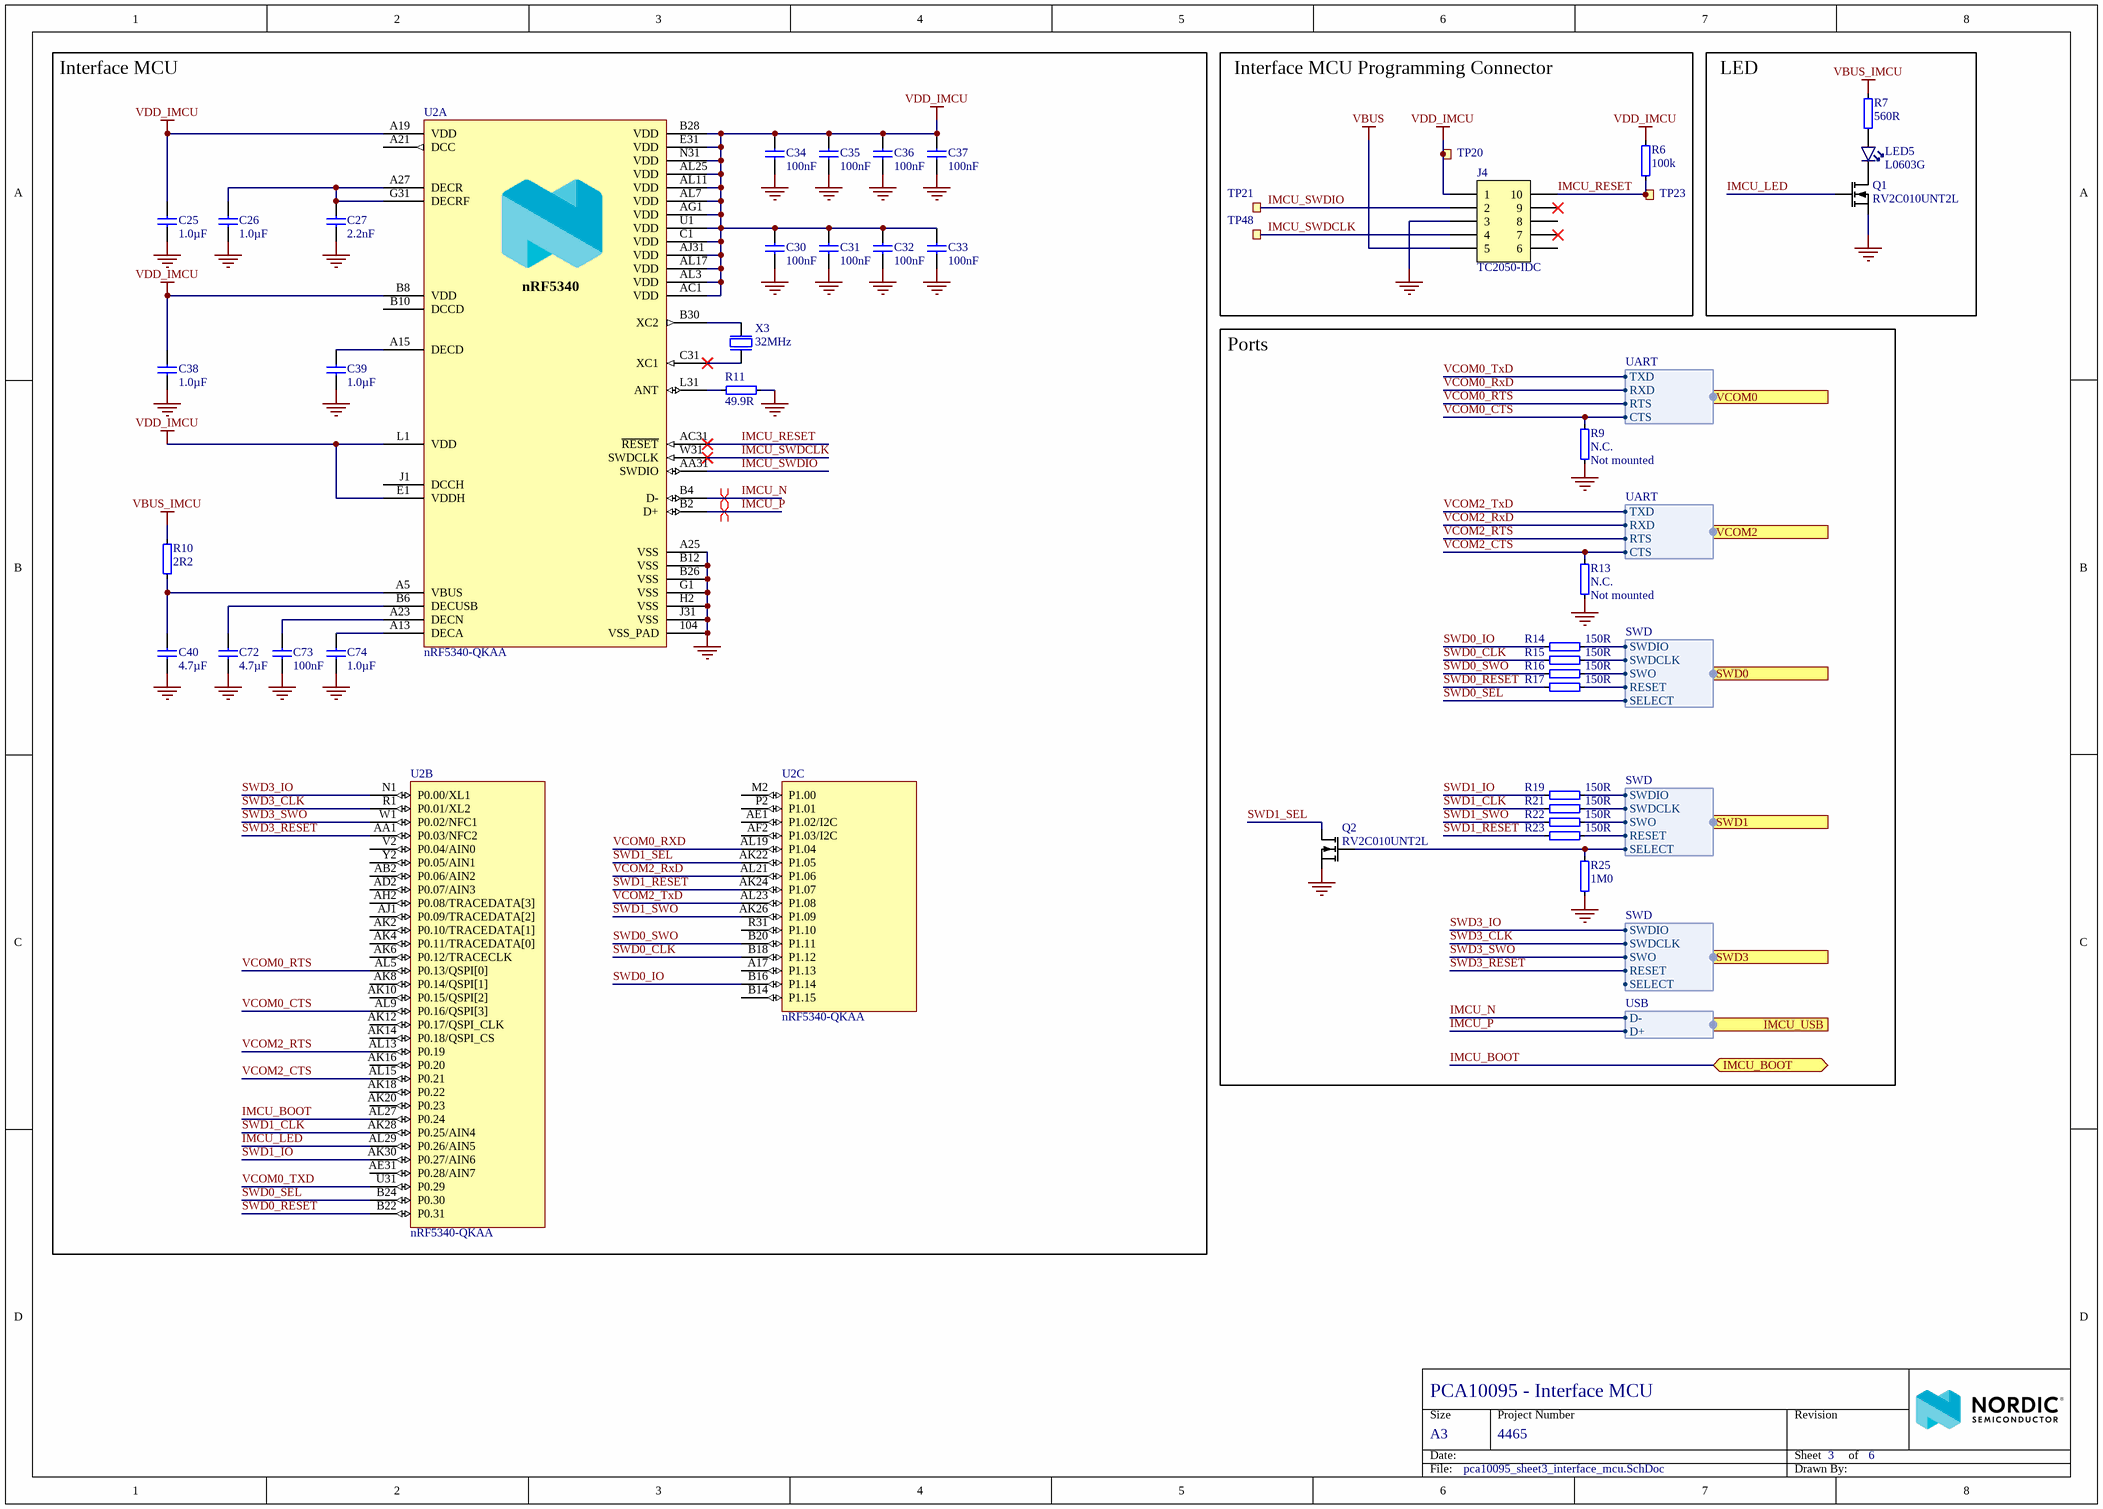
[diagram p2: pca10095_sheet3_interface_mcu.SchDoc]

### Parts
C25  1.0µF  [CAPC1005X04L]
C26  1.0µF  [CAPC1005X04L]
C27  2.2nF  [CAPC0603X03L_C]
C30  100nF  [CAPC0603X03L_C]
C31  100nF  [CAPC0603X03L_C]
C32  100nF  [CAPC0603X03L_C]
C33  100nF  [CAPC0603X03L_C]
C34  100nF  [CAPC0603X03L_C]
C35  100nF  [CAPC0603X03L_C]
C36  100nF  [CAPC0603X03L_C]
C37  100nF  [CAPC0603X03L_C]
C38  1.0µF  [CAPC1005X04L]
C39  1.0µF  [CAPC1005X04L]
C40  4.7µF  [CAPC1608X06L]
C72  4.7µF  [CAPC1608X06L]
C73  100nF  [CAPC0603X03L_C]
C74  1.0µF  [CAPC1005X04L]
J4  TC2050-IDC  [TC2050-IDC-NLFP]  (no BOM)
LED5  L0603G  [LED_0603_G]
Q1  RV2C010UNT2L  [DFN65P100X40-3L]
Q2  RV2C010UNT2L  [DFN65P100X40-3L]
R6  100k  [RESC0603X03L_C]
R7  560R  [RESC0603X03L_C]
R9  N.C.  Assembly: Not mounted  [RESC0603X03L_C_NC]
R10  2R2  [RESC0603X03L_C]
R11  49.9R  [RESC0603X03L_C]
R13  N.C.  Assembly: Not mounted  [RESC0603X03L_C_NC]
R14  150R  [RESC0603X03L_C]
R15  150R  [RESC0603X03L_C]
R16  150R  [RESC0603X03L_C]
R17  150R  [RESC0603X03L_C]
R19  150R  [RESC0603X03L_C]
R21  150R  [RESC0603X03L_C]
R22  150R  [RESC0603X03L_C]
R23  150R  [RESC0603X03L_C]
R25  1M0  [RESC0603X03L_C]
TP20  Ø1.5mm,SMD  [TP_SMD_Ø1.5mm]  (value not drawn)  (no BOM)
TP21  Ø1.5mm,SMD  [TP_SMD_Ø1.5mm]  (value not drawn)  (no BOM)
TP23  Ø1.5mm,SMD  [TP_SMD_Ø1.5mm]  (value not drawn)  (no BOM)
TP48  Ø1.5mm,SMD  [TP_SMD_Ø1.5mm]  (value not drawn)  (no BOM)
U2  nRF5340-QKAA  [AQFN40P700X700X85_HS-99N]  (parts A,B,C of 3)
X3  32MHz  [BT-XTAL_2016]

### Blocks framed on the sheet
Interface MCU: C25-C27 C30-C40 C72-C74 R10 R11 U2 X3
Interface MCU Programming Connector: J4 R6 TP20 TP21 TP23 TP48
LED: LED5 Q1 R7
Ports: Q2 R9 R13-R17 R19 R21-R23 R25

### Ports
IMCU_BOOT (bidir), IMCU_USB (harness USB), SWD0 (harness SWD), SWD1 (harness SWD), SWD3 (harness SWD), VCOM0 (harness UART), VCOM2 (harness UART)

### Harnesses
SWD: SWDIO, SWDCLK, SWO, RESET, SELECT
UART: RTS, CTS, RXD, TXD
USB: D+, D-

### Nets
GND: C25.2 C26.1 C27.2 C30.2 C31.2 C32.2 C33.2 C34.2 C35.2 C36.2 C37.2 C38.1 C39.1 C40.2 C72.2 C73.2 C74.1 J4.3 Q1.2(S) Q2.2(S) R9.2 R11.2 R13.2 R25.2 U2.104(VSS_PAD) U2.A25(VSS) U2.B12(VSS) U2.B26(VSS) U2.G1(VSS) U2.H2(VSS) U2.J31(VSS) X3.2(GND) X3.4(GND)
VBUS: J4.5
VBUS_IMCU: R7.2 R10.1
VDD_IMCU: C25.1 C30.1 C31.1 C32.1 C33.1 C34.1 C35.1 C36.1 C37.1 C38.2 J4.1 R6.2 TP20.1 U2.A19(VDD) U2.AC1(VDD) U2.AG1(VDD) U2.AJ31(VDD) U2.AL3(VDD) U2.AL7(VDD) U2.AL11(VDD) U2.AL17(VDD) U2.AL25(VDD) U2.B8(VDD) U2.B28(VDD) U2.C1(VDD) U2.E1(VDDH) U2.E31(VDD) U2.L1(VDD) U2.N31(VDD) U2.U1(VDD)
IMCU_BOOT: U2.AL27(P0.24) ; port IMCU_BOOT
IMCU_LED: Q1.1(G) U2.AL29(P0.26/AIN5)
IMCU_N: U2.B4(D-) ; port IMCU_USB.D-
IMCU_P: U2.B2(D+) ; port IMCU_USB.D+
IMCU_RESET: J4.10 R6.1 TP23.1 U2.AC31(~{RESET})
IMCU_SWDCLK: J4.4 TP48.1 U2.W31(SWDCLK)
IMCU_SWDIO: J4.2 TP21.1 U2.AA31(SWDIO)
SWD0_CLK: R15.1 U2.B18(P1.12)
SWD0_IO: R14.1 U2.B16(P1.14)
SWD0_RESET: R17.1 U2.B22(P0.31)
SWD0_RESET': R17.2 ; port SWD0.RESET
SWD0_SEL: U2.B24(P0.30) ; port SWD0.SELECT
SWD0_SWDCLK: R15.2 ; port SWD0.SWDCLK
SWD0_SWDIO: R14.2 ; port SWD0.SWDIO
SWD0_SWO: R16.1 U2.B20(P1.11)
SWD0_SWO': R16.2 ; port SWD0.SWO
SWD1_CLK: R21.1 U2.AK28(P0.25/AIN4)
SWD1_IO: R19.1 U2.AK30(P0.27/AIN6)
SWD1_RESET: R23.1 U2.AK24(P1.07)
SWD1_SEL: Q2.3(D) U2.AK22(P1.05)
SWD1_SWO: R22.1 U2.AK26(P1.09)
SWD3_CLK: U2.R1(P0.01/XL2) ; port SWD3.SWDCLK
SWD3_IO: U2.N1(P0.00/XL1) ; port SWD3.SWDIO
SWD3_RESET: U2.AA1(P0.03/NFC2) ; port SWD3.RESET
SWD3_SWO: U2.W1(P0.02/NFC1) ; port SWD3.SWO
VCOM0_CTS: R9.1 U2.AL9(P0.16/QSPI[3]) ; port VCOM0.CTS
VCOM0_RTS: U2.AL5(P0.13/QSPI[0]) ; port VCOM0.RTS
VCOM0_RXD: U2.AL19(P1.04) ; port VCOM0.RXD
VCOM0_TXD: U2.U31(P0.29) ; port VCOM0.TXD
VCOM2_CTS: R13.1 U2.AL15(P0.21) ; port VCOM2.CTS
VCOM2_RTS: U2.AL13(P0.19) ; port VCOM2.RTS
VCOM2_RxD: U2.AL21(P1.06) ; port VCOM2.RXD
VCOM2_TxD: U2.AL23(P1.08) ; port VCOM2.TXD
NetC26_2: C26.2 C27.1 U2.A27(DECR) U2.G31(DECRF)
NetC39_2: C39.2 U2.A15(DECD)
NetC40_1: C40.1 R10.2 U2.A5(VBUS)
NetC72_1: C72.1 U2.B6(DECUSB)
NetC73_1: C73.1 U2.A23(DECN)
NetC74_2: C74.2 U2.A13(DECA)
NetLED5_1: LED5.1(C) Q1.3(D)
NetLED5_2: LED5.2(A) R7.1
NetP20_3: Q2.1(G) R25.1 ; port SWD1.SELECT
NetP20_4: R19.2 ; port SWD1.SWDIO
NetP20_5: R21.2 ; port SWD1.SWDCLK
NetP20_6: R22.2 ; port SWD1.SWO
NetP20_7: R23.2 ; port SWD1.RESET
NetR11_1: R11.1 U2.L31(ANT)
NetU2_B30: U2.B30(XC2) X3.3(out)
NetU2_C31: U2.C31(XC1) X3.1(inp)

Not connected (* = marked no-connect by the designer): J4 6 7* 8 9*; U2 A17(P1.13) A21(DCC) AB2(P0.06/AIN2) AD2(P0.07/AIN3) AE1(P1.02/I2C) AE31(P0.28/AIN7) AF2(P1.03/I2C) AG31(N.C.) AH2(P0.08/TRACEDATA[3]) AJ1(P0.09/TRACEDATA[2]) AK2(P0.10/TRACEDATA[1]) AK4(P0.11/TRACEDATA[0]) AK6(P0.12/TRACECLK) AK8(P0.14/QSPI[1]) AK10(P0.15/QSPI[2]) AK12(P0.17/QSPI_CLK) AK14(P0.18/QSPI_CS) AK16(P0.20) AK18(P0.22) AK20(P0.23) B10(DCCD) B14(P1.15) D2(N.C.) F2(N.C.) J1(DCCH) M2(P1.00) P2(P1.01) R31(P1.10) T2(N.C.) V2(P0.04/AIN0) Y2(P0.05/AIN1)

### Layout directives
differential pair: IMCU_N, IMCU_P

### Notes on the sheet
- Size
- Date:
- A3
- Project Number
- Sheet         of
- Revision
- File:
- Drawn By:
- (in symbol nRF5340-QKAAD0, part A) nRF5340

### Library data of the parts
C25 C26 C38 C39 C74 = C0402-1µ0: Capacitor, X5R, ±5%, 6.3V; Manufacturer: N.A.; Part number IPS: 00000007786, 00000003457; Pad Count: 2; Artikkelnr Noca: 20039235; Part Number: C0402-1µ0; Value: 1.0µF; Footprint Doc: 0402; Component Class: Capacitors; Author: rsk; PartId: 100200190; Manufacturer Part Number: N.A.; ComponentLink1URL: N.A.; ComponentLink1Description: Datasheet; ComponentLink2URL: N.A.; ComponentLink2Description: Supplier link; HelpURL: N.A.; LatestRevisionDate: 2016-08-22; Published: 2009-05-08; Note: 6.3V; Supplier 1: Digi-Key; Supplier Part Number 1: 1276-1444-1-ND; Supplier 2: N.A.; Supplier Part Number 2: N.A.; Part number Norautron: N.A.
C27 = C0201-2n2: as C4 on sheet pca10095_sheet2_nrf5340_mcu; Part Number: C0201-2n2; Value: 2.2nF; Footprint Doc: 0201; Component Class: Capacitors; Author: rsk; PartId: 100200060; Manufacturer Part Number: N.A.; ComponentLink1URL: N.A.; ComponentLink1Description: Datasheet; ComponentLink2URL: N.A.; ComponentLink2Description: Supplier link; HelpURL: N.A.; LatestRevisionDate: 2014-11-13; Published: 2014-11-13; Note: 10V; Supplier 1: N.A.; Supplier Part Number 1: N.A.; Supplier 2: N.A.; Supplier Part Number 2: N.A.; Artikkelnr Noca: N.A.; Part number Norautron: N.A.
C30-C37 C73 = C0201-100n: Capacitor, X5R, ±10%; Manufacturer: N.A.; Part number IPS: 00000001248, 00000002505; Pad Count: 2; Note: 16V; Part Number: C0201-100n; Value: 100nF; Footprint Doc: 0201; Component Class: Capacitors; Author: rsk; PartId: 100200078; Manufacturer Part Number: N.A.; ComponentLink1URL: N.A.; ComponentLink1Description: Datasheet; ComponentLink2URL: N.A.; ComponentLink2Description: Supplier link; HelpURL: N.A.; LatestRevisionDate: 2017-11-09; Published: 2014-11-13; Supplier 1: N.A.; Supplier Part Number 1: N.A.; Supplier 2: N.A.; Supplier Part Number 2: N.A.; Artikkelnr Noca: N.A.; Part number Norautron: N.A.
C40 = C0603-4µ7-10V-X7S: Capacitor, X7S, ±10%, 10V; Manufacturer: N.A.; Part number IPS: 00000001779; Pad Count: 2; Artikkelnr Noca: 20030013; Part Number: C0603-4µ7-10V-X7S; Value: 4.7µF; Footprint Doc: 0603; Component Class: Capacitors; Author: rsk; PartId: 100200351; Manufacturer Part Number: N.A.; ComponentLink1URL: N.A.; ComponentLink1Description: Datasheet; ComponentLink2URL: N.A.; ComponentLink2Description: Supplier link; HelpURL: N.A.; LatestRevisionDate: 2016-08-15; Published: 2016-08-15; Note: 10V; Supplier 1: Digi-Key; Supplier Part Number 1: 445-14258-1-ND; Supplier 2: N.A.; Supplier Part Number 2: N.A.; Part number Norautron: N.A.
C72 = C0603-4µ7-6.3V-X7R: Capacitor, X7R, ±10%, 6.3V; Manufacturer: Samsung Electro-Mechanics America; Manufacturer Part Number: CL10B475KQ8NQNC; Part number IPS: 00000002541; Part number Norautron: N.A.; Pad Count: 2; Artikkelnr Noca: 20039473; Part Number: C0603-4µ7-6.3V-X7R; Value: 4.7µF; Footprint Doc: 0603; Component Class: Capacitors; Author: rsk; PartId: 100200350; ComponentLink1URL: N.A.; ComponentLink1Description: Datasheet; ComponentLink2URL: N.A.; ComponentLink2Description: Supplier link; HelpURL: http://media.digikey.com/pdf/Data%20Sheets/Samsung%20PDFs/CL10B475KQ8NQNC_Spec.pdf; LatestRevisionDate: 2015-06-10; Published: 2015-06-10; Note: 6.3V; Supplier 1: Digi-Key; Supplier Part Number 1: 1276-2087-1-ND; Supplier 2: N.A.; Supplier Part Number 2: N.A.
J4 = TC2050-IDC-NLFP: CBL PLUG-OF-NAILS 10-PIN; Manufacturer: Tag-Connect LLC; Artikkelnr Noca: N.A.; Pad Count: 10; Part Number: TC2050-IDC-NLFP; Manufacturer Part Number: TC2050-IDC-NLFP; LatestRevisionDate: 2012-11-21; Publisher: Nordic Semiconductor; Published: 2012-11-21; Value: TC2050-IDC; Pin Count: 10; Footprint Doc: TC2050-IDC-NLFP; Part number IPS: N.A.; ComponentLink1URL: N.A.; ComponentLink1Description: Datasheet; ComponentLink2URL: N.A.; ComponentLink2Description: Supplier link; HelpURL: http://www.tag-connect.com/Materials/TC2050-IDC%20Datasheet.pdf; Supplier 1: Digi-Key; Supplier Part Number 1: TC2050-IDC-NL-ND; Supplier 2: N.A.; Supplier Part Number 2: N.A.; Component Class: Connectors; Note: N.A.; PartId: 100500463
LED5 = LG L29K Smartled Green: LED, Green, 0603, 570nm, Vf=1.7V, 2.24..5.6mcd, - 40 to +100°C; Manufacturer: Osram; Manufacturer Part Number: LG L29K-G2J1-24-Z; Part number IPS: 00000009961; Part number Norautron: N.A.; Note: 2.24..5.6 mcd, Vfmin=1.7V; Artikkelnr Noca: 13019147; Pad Count: 2; Part Number: LG L29K Smartled Green; Footprint Doc: 0603; LatestRevisionDate: 2017-08-21; Published: 2014-10-28; Value: L0603G; ComponentLink1URL: N.A.; ComponentLink1Description: Datasheet; ComponentLink2URL: N.A.; ComponentLink2Description: Supplier link; HelpURL: http://www.osram-os.com/Graphics/XPic2/00077107_0.pdf; Supplier 1: Digi-Key; Supplier Part Number 1: 475-2709-1-ND; Supplier 2: Mouser; Supplier Part Number 2: 720-LGL29KG2J124Z; PartId: 101400096; Component Class: Optoelectronics; Author: rsk
Q1 Q2 = RV2C010UNT2L: N-Channel MOSFET, 20V, 1A, 470mOhm, 400mW; Manufacturer: Rohm Semiconductor; Part number IPS: 00000009976; Note: N.A.; Artikkelnr Noca: 35010020; Pad Count: 3; Part Number: RV2C010UNT2L; Manufacturer Part Number: RV2C010UNT2L; ComponentLink1URL: N.A.; ComponentLink1Description: Datasheet; ComponentLink2URL: N.A.; ComponentLink2Description: Supplier link; HelpURL: http://rohmfs.rohm.com/en/products/databook/datasheet/discrete/transistor/mosfet/rv2c010unt2l-e.pdf; Footprint Doc: DFN-3; LatestRevisionDate: 2016-08-09; Published: 2016-08-09; Value: RV2C010UNT2L; Supplier 1: Digi-Key; Supplier Part Number 1: RV2C010UNT2LCT-ND; Supplier 2: Mouser; Supplier Part Number 2: 755-RV2C010UNT2L; PartId: 101300132; Component Class: Semiconductors; Author: rsk; Part number Norautron: N.A.
R6 = R0201-100k: Resistor, ±1%, 0.05W; Manufacturer: N.A.; Part number IPS: 00000001419; Note: Chip Res 1%; Pad Count: 2; Part Number: R0201-100k; Manufacturer Part Number: N.A.; ComponentLink1URL: N.A.; ComponentLink1Description: Datasheet; ComponentLink2URL: N.A.; ComponentLink2Description: Supplier link; HelpURL: N.A.; Footprint Doc: 0201; LatestRevisionDate: 2014-11-13; Pin Count: 2; Publisher: Nordic Semiconductor; Published: 2014-11-13; Value: 100k; Artikkelnr Noca: N.A.; Supplier 1: N.A.; Supplier Part Number 1: N.A.; Supplier 2: N.A.; Supplier Part Number 2: N.A.; Component Class: Resistors; PartId: 100100080
R7 = R0201-560: Resistor, ±1%, 0.05W; Manufacturer: N.A.; Note: Chip Res 1%; Pad Count: 2; Part Number: R0201-560; Manufacturer Part Number: N.A.; ComponentLink1URL: N.A.; ComponentLink1Description: Datasheet; ComponentLink2URL: N.A.; ComponentLink2Description: Supplier link; HelpURL: N.A.; Footprint Doc: 0201; LatestRevisionDate: 2014-11-13; Published: 2014-11-13; Value: 560R; Supplier 1: N.A.; Supplier Part Number 1: N.A.; Supplier 2: N.A.; Supplier Part Number 2: N.A.; Artikkelnr Noca: N.A.; Part number IPS: N.A.; PartId: 100100038; Component Class: Resistors; Author: rsk; Part number Norautron: N.A.
R9 R13 = R0201-N.C.: Not mounted; Manufacturer: N.A.; Note: Chip Res; Pad Count: 2; Part Number: R0201-N.C.; Manufacturer Part Number: N.A.; ComponentLink1URL: N.A.; ComponentLink1Description: Datasheet; ComponentLink2URL: N.A.; ComponentLink2Description: Supplier link; HelpURL: N.A.; Footprint Doc: 0201; LatestRevisionDate: 2014-11-13; Published: 2014-11-13; Value: N.C.; Supplier 1: N.A.; Supplier Part Number 1: N.A.; Supplier 2: N.A.; Supplier Part Number 2: N.A.; Artikkelnr Noca: N.A.; Part number IPS: N.A.; PartId: 100100107; Component Class: Resistors; Author: rsk; Part number Norautron: N.A.
R10 = R0201-2R2: Resistor, ±1%, 0.05W; Manufacturer: N.A.; Pad Count: 2; Note: Chip Res 1%; Part Number: R0201-2R2; Footprint Doc: 0201; Value: 2R2; Component Class: Resistors; Author: rsk; PartId: 100100006; Manufacturer Part Number: N.A.; ComponentLink1URL: N.A.; ComponentLink1Description: Datasheet; ComponentLink2URL: N.A.; ComponentLink2Description: Supplier link; HelpURL: N.A.; LatestRevisionDate: 2014-11-13; Published: 2014-11-13; Supplier 1: N.A.; Supplier Part Number 1: N.A.; Supplier 2: N.A.; Supplier Part Number 2: N.A.; Artikkelnr Noca: N.A.; Part number IPS: N.A.; Part number Norautron: N.A.
R11 = R0201-49R9: Resistor, ±1%, 0.05W; Manufacturer: N.A.; Pad Count: 2; Note: Chip Res 1%; Part Number: R0201-49R9; PartId: 100100612; Component Class: Resistors; Author: getr; Manufacturer Part Number: N.A.; ComponentLink1URL: N.A.; ComponentLink1Description: Datasheet; ComponentLink2URL: N.A.; ComponentLink2Description: Supplier link; HelpURL: N.A.; Footprint Doc: 0201; LatestRevisionDate: 2021-04-15; Published: 2021-04-15; Value: 49.9R; Supplier 1: N.A.; Supplier Part Number 1: N.A.; Supplier 2: N.A.; Supplier Part Number 2: N.A.; Artikkelnr Noca: N.A.; Part number IPS: N.A.; Part number Norautron: N.A.
R14-R17 R19 R21-R23 = R0201-150: Resistor, ±1%, 0.05W; Manufacturer: N.A.; Part number IPS: 00000001420; Note: Chip Res 1%; Pad Count: 2; Part Number: R0201-150; Manufacturer Part Number: N.A.; ComponentLink1URL: N.A.; ComponentLink1Description: Datasheet; ComponentLink2URL: N.A.; ComponentLink2Description: Supplier link; HelpURL: N.A.; Footprint Doc: 0201; LatestRevisionDate: 2014-11-13; Published: 2014-11-13; Value: 150R; Artikkelnr Noca: N.A.; Supplier 1: N.A.; Supplier Part Number 1: N.A.; Supplier 2: N.A.; Supplier Part Number 2: N.A.; PartId: 100100029; Component Class: Resistors; Author: rsk; Part number Norautron: N.A.
R25 = R0201-1M0: Resistor, ±1%, 0.05W; Manufacturer: N.A.; Part number IPS: 00000001418; Note: Chip Res 1%; Pad Count: 2; Part Number: R0201-1M0; Manufacturer Part Number: N.A.; ComponentLink1URL: N.A.; ComponentLink1Description: Datasheet; ComponentLink2URL: N.A.; ComponentLink2Description: Supplier link; HelpURL: N.A.; Footprint Doc: 0201; LatestRevisionDate: 2014-11-13; Published: 2014-11-13; Value: 1M0; Supplier 1: N.A.; Supplier Part Number 1: N.A.; Supplier 2: N.A.; Supplier Part Number 2: N.A.; Artikkelnr Noca: N.A.; PartId: 100100093; Component Class: Resistors; Author: rsk; Part number Norautron: N.A.
TP20 TP21 TP23 TP48 = TP_SMD_Ø1.5MM: 1.5mm circular SMD testpad; Manufacturer: Nordic Semiconductor; Manufacturer Part Number: N.A.; Pad Count: 1; Part Number: TP_SMD_Ø1.5MM; ComponentLink1URL: N.A.; ComponentLink1Description: Datasheet; ComponentLink2URL: N.A.; ComponentLink2Description: Supplier link; HelpURL: N.A.; Footprint Doc: TP_SMD_Ø1.5mm; LatestRevisionDate: 2016-06-02; Pin Count: 1; Publisher: Nordic Semiconductor; Published: 2016-06-02; Value: Ø1.5mm,SMD; Note: N.A.; Artikkelnr Noca: N.A.; Part number IPS: N.A.; Supplier 1: N.A.; Supplier Part Number 1: N.A.; Supplier 2: N.A.; Supplier Part Number 2: N.A.; Component Class: Connectors; PartId: 100500477
U2 = nRF5340-QKAAD0: Multi-protocol Bluetooth Low Energy, IEEE 802.15.4, ANT and 2.4GHz proprietary system-on-chip; Manufacturer: Nordic Semiconductor; Pad Count: 98; Note: N.A.; Part Number: nRF5340-QKAAD0; Footprint Doc: AQFN-98; Value: nRF5340-QKAA; Component Class: nRF_Devices; Author: rsk; PartId: 102000216; Manufacturer Part Number: nRF5340-QKAAD0; ComponentLink1URL: N.A.; ComponentLink1Description: Datasheet; ComponentLink2URL: N.A.; ComponentLink2Description: Supplier link; HelpURL: N.A.; LatestRevisionDate: 2020-12-02; Published: 2020-12-02; Supplier 1: Nordic Semiconductor; Supplier Part Number 1: nRF5340-QKAAD0; Supplier 2: N.A.; Supplier Part Number 2: N.A.; Artikkelnr Noca: N.A.; Part number IPS: N.A.; Part number Norautron: N.A.
X3 = XTAL_SMD2016_32MHz_8pF_Golledge: as X1 on sheet pca10095_sheet2_nrf5340_mcu; Part Number: XTAL_SMD2016_32MHz_8pF_Golledge; Manufacturer: Golledge; LatestRevisionDate: 2016-11-02; Published: 2016-11-02; Value: 32MHz; Footprint Doc: XTAL_2016; ComponentLink1URL: N.A.; ComponentLink1Description: Datasheet; ComponentLink2URL: N.A.; ComponentLink2Description: Supplier link; HelpURL: \\hizz\pro\app9717\Datasheet\crystals\Golledge\mp06003.pdf; Supplier 1: Link Nordic; Supplier Part Number 1: N.A.; Supplier 2: N.A.; Supplier Part Number 2: N.A.; PartId: 101600041; Component Class: Oscillators